# Altium project Project_BEESC.PrjPcb (part 1 of 4)
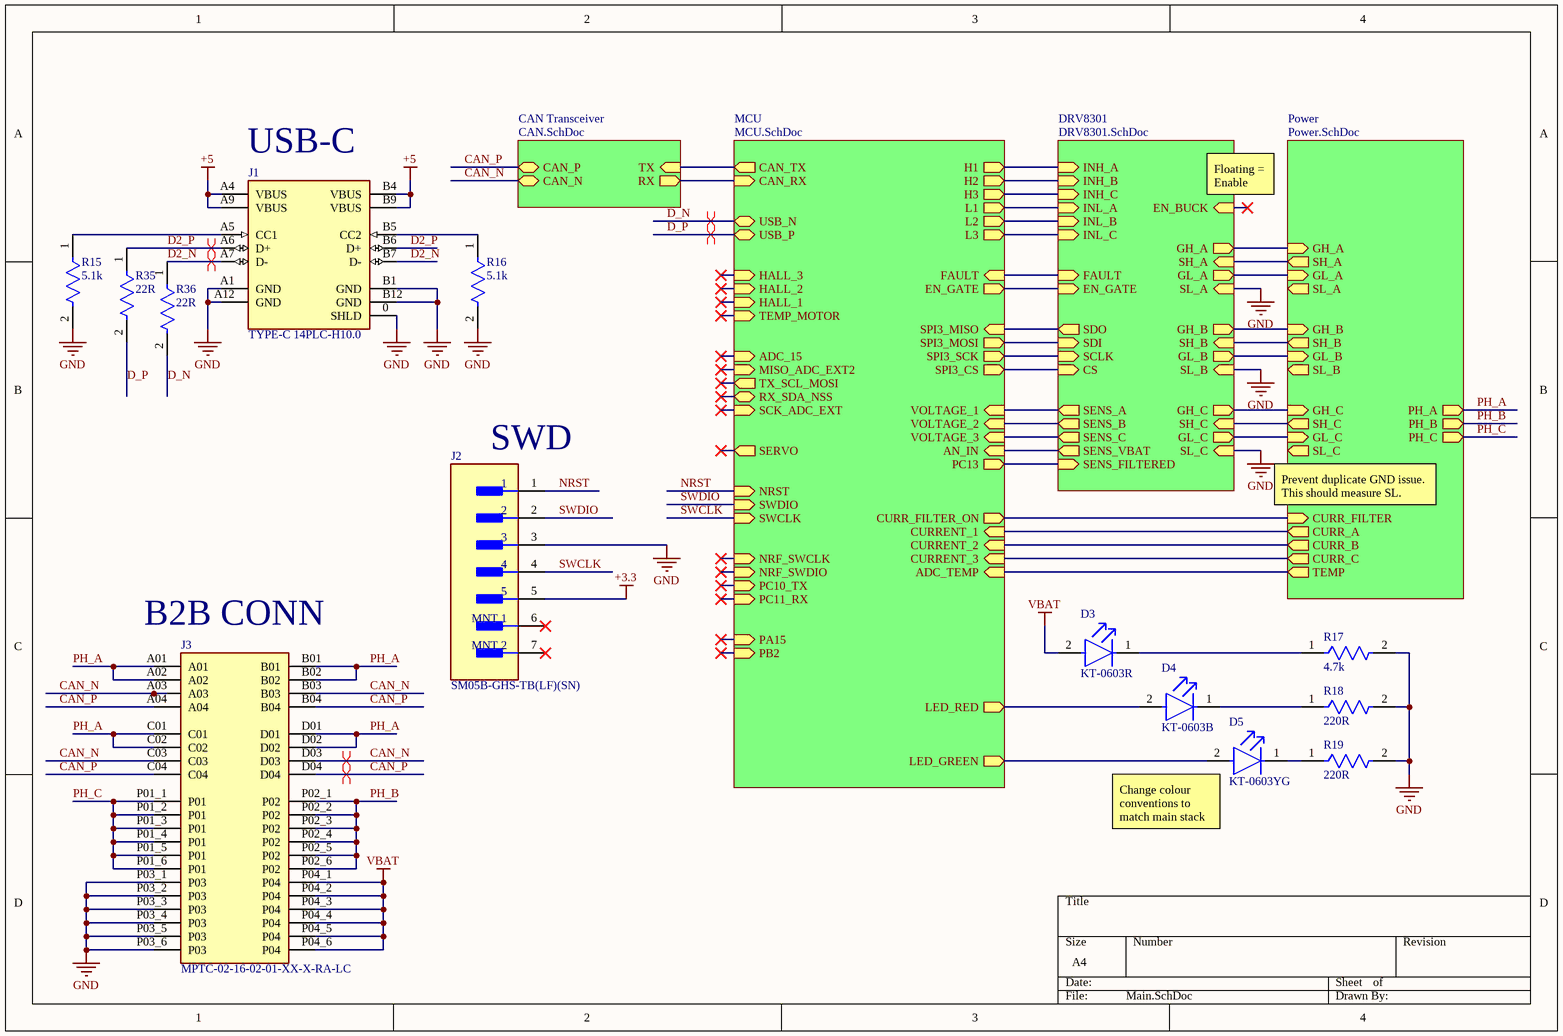
[diagram p0: Main.SchDoc]
5 sheets, 122 parts. Net scope: hierarchical (ports join the sheet entries above them; power ports are global).
Board files: BEESC_v1_L8.PcbDoc, BEESC_v1.PcbDoc
Sheets:
  Main.SchDoc
    MCU = MCU.SchDoc
    CAN Transceiver = CAN.SchDoc
    DRV8301 = DRV8301.SchDoc
    Power = Power.SchDoc

## Sheet Main.SchDoc
size A4; SheetNumber: 1; SheetTotal: 5

### Parts
D3  KT-0603R  [KT-0603R]
D4  KT-0603B  [KT-0603B]
D5  KT-0603YG  [KT-0603YG]
J1  TYPE-C 14PLC-H10.0  [TYPE-C 14PLC-H10.0]
J2  SM05B-GHS-TB(LF)(SN)  [SM05B-GHS-TB(LF)(SN)]
J3  MPTC-02-16-02-01-XX-X-RA-LC  [SAMTEC_MPTC-02-16-02-01-XX-X-RA-LC]
R15  5.1k  [FP-AC0402-MFG]
R16  5.1k  [FP-AC0402-MFG]
R17  4.7k  [FP-AC0402-MFG]
R18  220R  [FP-AC0402-MFG]
R19  220R  [FP-AC0402-MFG]
R35  22R  [FP-AC0402-MFG]
R36  22R  [FP-AC0402-MFG]

### Sub-sheets
CAN Transceiver = CAN.SchDoc: TX (in), RX (out), CAN_P (bidir), CAN_N (bidir)
DRV8301 = DRV8301.SchDoc: INH_A (in), INH_B (in), INH_C (in), INL_A (in), INL_B (in), INL_C (in), FAULT (in), EN_GATE (in), SDO (out), SDI (in), SCLK (in), CS (in), SENS_A (out), SENS_B (out), SENS_C (out), SENS_VBAT (out), SENS_FILTERED (in), GH_A (out), SH_A (in), GL_A (out), SL_A (in), EN_BUCK (in), GH_B (out), SH_B (in), GL_B (out), SL_B (in), GH_C (out), SH_C (in), GL_C (out), SL_C (in)
MCU = MCU.SchDoc: USB_N (bidir), USB_P (bidir), CAN_TX (out), CAN_RX (in), HALL_3 (in), HALL_2 (in), HALL_1 (in), TEMP_MOTOR (in), ADC_15 (in), MISO_ADC_EXT2 (in), TX_SCL_MOSI (out), RX_SDA_NSS (bidir), SCK_ADC_EXT (in), SERVO (out), SWCLK (in), SWDIO (in), NRST (in), NRF_SWCLK (in), NRF_SWDIO (in), PC10_TX (in), PC11_RX (in), PA15 (in), PB2 (in), LED_RED (out), LED_GREEN (out), H1 (out), H3 (out), H2 (out), L1 (out), L3 (out), L2 (out), FAULT (in), EN_GATE (out), SPI3_CS (out), SPI3_SCK (out), SPI3_MOSI (out), SPI3_MISO (in), VOLTAGE_1 (in), VOLTAGE_2 (in), VOLTAGE_3 (in), AN_IN (in), PC13 (out), CURR_FILTER_ON (out), CURRENT_1 (in), CURRENT_2 (in), CURRENT_3 (in), ADC_TEMP (in)
Power = Power.SchDoc: GH_A (in), SH_A (out), GL_A (in), SL_A (out), GH_B (in), SH_B (out), GL_B (in), SL_B (out), GH_C (in), SH_C (out), GL_C (in), SL_C (out), PH_A (out), PH_B (out), PH_C (out), CURR_FILTER (in), CURR_A (out), CURR_B (out), CURR_C (out), TEMP (out)

### Nets
+3.3: J2.5
+5: J1.A4(VBUS) J1.A9(VBUS) J1.B4(VBUS) J1.B9(VBUS)
GND: J1.0(SHLD) J1.A1(GND) J1.A12(GND) J1.B1(GND) J1.B12(GND) J2.3 J3.P03_1(P03) J3.P03_2(P03) J3.P03_3(P03) J3.P03_4(P03) J3.P03_5(P03) J3.P03_6(P03) R15.2 R16.2 R17.2 R18.2 R19.2 ; sheet DRV8301/SL_A, sheet DRV8301/SL_B, sheet DRV8301/SL_C
VBAT: D3.2(A) J3.P04_1(P04) J3.P04_2(P04) J3.P04_3(P04) J3.P04_4(P04) J3.P04_5(P04) J3.P04_6(P04)
ADC_TEMP: sheet MCU/ADC_TEMP, sheet Power/TEMP
AN_IN: sheet MCU/AN_IN, sheet DRV8301/SENS_VBAT
CAN_N: J3.A03 J3.B03 J3.C03 J3.D03 ; sheet CAN Transceiver/CAN_N
CAN_P: J3.A04 J3.B04 J3.C04 J3.D04 ; sheet CAN Transceiver/CAN_P
CAN_RX: sheet MCU/CAN_RX, sheet CAN Transceiver/RX
CAN_TX: sheet MCU/CAN_TX, sheet CAN Transceiver/TX
CS: sheet MCU/SPI3_CS, sheet DRV8301/CS
CURR_A: sheet MCU/CURRENT_1, sheet Power/CURR_A
CURR_B: sheet MCU/CURRENT_2, sheet Power/CURR_B
CURR_C: sheet MCU/CURRENT_3, sheet Power/CURR_C
CURR_FILTER: sheet MCU/CURR_FILTER_ON, sheet Power/CURR_FILTER
D2_N: J1.A7(D-) J1.B7(D-) R36.1
D2_P: J1.A6(D+) J1.B6(D+) R35.1
D_N: R36.2 ; sheet MCU/USB_N
D_P: R35.2 ; sheet MCU/USB_P
EN_GATE: sheet MCU/EN_GATE, sheet DRV8301/EN_GATE
FAULT: sheet MCU/FAULT, sheet DRV8301/FAULT
GH_A: sheet DRV8301/GH_A, sheet Power/GH_A
GH_B: sheet DRV8301/GH_B, sheet Power/GH_B
GH_C: sheet DRV8301/GH_C, sheet Power/GH_C
GL_A: sheet DRV8301/GL_A, sheet Power/GL_A
GL_B: sheet DRV8301/GL_B, sheet Power/GL_B
GL_C: sheet DRV8301/GL_C, sheet Power/GL_C
H1: sheet MCU/H1, sheet DRV8301/INH_A
H2: sheet MCU/H2, sheet DRV8301/INH_B
H3: sheet MCU/H3, sheet DRV8301/INH_C
INL_A: sheet MCU/L1, sheet DRV8301/INL_A
INL_B: sheet MCU/L2, sheet DRV8301/INL_B
INL_C: sheet MCU/L3, sheet DRV8301/INL_C
LED_GREEN: D5.2(A) ; sheet MCU/LED_GREEN
LED_RED: D4.2(A) ; sheet MCU/LED_RED
NRST: J2.1 ; sheet MCU/NRST
PC13: sheet MCU/PC13, sheet DRV8301/SENS_FILTERED
PH_A: J3.A01 J3.A02 J3.B01 J3.B02 J3.C01 J3.C02 J3.D01 J3.D02 ; sheet Power/PH_A
PH_B: J3.P02_1(P02) J3.P02_2(P02) J3.P02_3(P02) J3.P02_4(P02) J3.P02_5(P02) J3.P02_6(P02) ; sheet Power/PH_B
PH_C: J3.P01_1(P01) J3.P01_2(P01) J3.P01_3(P01) J3.P01_4(P01) J3.P01_5(P01) J3.P01_6(P01) ; sheet Power/PH_C
SCLK: sheet MCU/SPI3_SCK, sheet DRV8301/SCLK
SDI: sheet MCU/SPI3_MOSI, sheet DRV8301/SDI
SDO: sheet MCU/SPI3_MISO, sheet DRV8301/SDO
SENS_A: sheet MCU/VOLTAGE_1, sheet DRV8301/SENS_A
SENS_B: sheet MCU/VOLTAGE_2, sheet DRV8301/SENS_B
SENS_C: sheet MCU/VOLTAGE_3, sheet DRV8301/SENS_C
SH_A: sheet DRV8301/SH_A, sheet Power/SH_A
SH_B: sheet DRV8301/SH_B, sheet Power/SH_B
SH_C: sheet DRV8301/SH_C, sheet Power/SH_C
SWCLK: J2.4 ; sheet MCU/SWCLK
SWDIO: J2.2 ; sheet MCU/SWDIO
NetD3_1: D3.1(C) R17.1
NetD4_1: D4.1(C) R18.1
NetD5_1: D5.1(C) R19.1
NetJ1_A5: J1.A5(CC1) R15.1
NetJ1_B5: J1.B5(CC2) R16.1

Not connected (* = marked no-connect by the designer): J2 6(MNT_1)* 7(MNT_2)*

### Layout directives
differential pair: CAN_N, CAN_P, D2_N, D2_P, D_N, D_P

### Notes on the sheet
- (near J1) USB-C
- Floating = Enable
- (near J2) SWD
- Prevent duplicate GND issue.
  This should measure SL.
- (near J3) B2B CONN
- (near D5) Change colour conventions to match main stack

### Library data of the parts
D3 = KT-0603R: -40℃~+85℃ 120° 2.4V 20mA 300mcd 40mW 615nm~630nm 645nm Red Water Clear 0603 LED Indication - Discrete ROHS
D4 = KT-0603B: 100mW 120° 175mcd 3.1V 460nm~475nm 469nm 5mA Blue Water Clear 0603 LED Indication - Discrete ROHS
D5 = KT-0603YG: -40℃~+85℃ 120° 20mA 2V~2.2V 30mcd~42mcd 40mW 567nm~573nm Discrete Diode Top-mount Water Clear Yellow Green 0603 LED Indication - Discrete ROHS
J1 = TYPE-C 14PLC-H10.0: -40℃~+85℃ 1 10,000 Cycles 14P 20V 5A Black Female Through Hole Type-C USB 3.1 Plugin USB Connectors ROHS
J2 = SM05B-GHS-TB(LF)(SN): Connector Header, GH Series, 5 Position, 1.25mm, Surface Mount, Right Angle, Tin, Natural
J3 = CMP-414-000000-2: 5mm (.1969 Inch) / 2mm (.0787 Inch) Pitch Power / Signal, Board to Board / Wire to Board Shrouded Box Header Connectors, Vertical or Right Angle, Locking Clip Option, PowerStrip™/30 Amps; MF: Samtec; Price: None; Component Type: Standard; Pin Count: 40; MP: MPTC-02-16-02-01-XX-X-RA-LC; Design Item ID: MPTC-02-16-02-01-XX-X-RA-LC; Availability: Unavailable; Value: *; Package: None; Source: MPTC-02-16-02-01-XX-X-RA-LC.SchLib; System: Connector
R15 R16 = 0402WGF5101TCE: -55℃~+155℃ 5.1kΩ 50V 62.5mW Thick Film Resistor ±1% ±100ppm/℃ 0402 Chip Resistor - Surface Mount ROHS
R17 = 0402WGF4701TCE: -55℃~+155℃ 4.7kΩ 50V 62.5mW Thick Film Resistor ±1% ±100ppm/℃ 0402 Chip Resistor - Surface Mount ROHS
R18 R19 = 0402WGF2200TCE: -55℃~+155℃ 220Ω 50V 62.5mW Thick Film Resistor ±1% ±100ppm/℃ 0402 Chip Resistor - Surface Mount ROHS
R35 R36 = 0402WGF220JTCE: -55℃~+155℃ 22Ω 50V 62.5mW Thick Film Resistor ±1% ±100ppm/℃ 0402 Chip Resistor - Surface Mount ROHS

## Sheet MCU.SchDoc
size A4; SheetNumber: 3; SheetTotal: 5
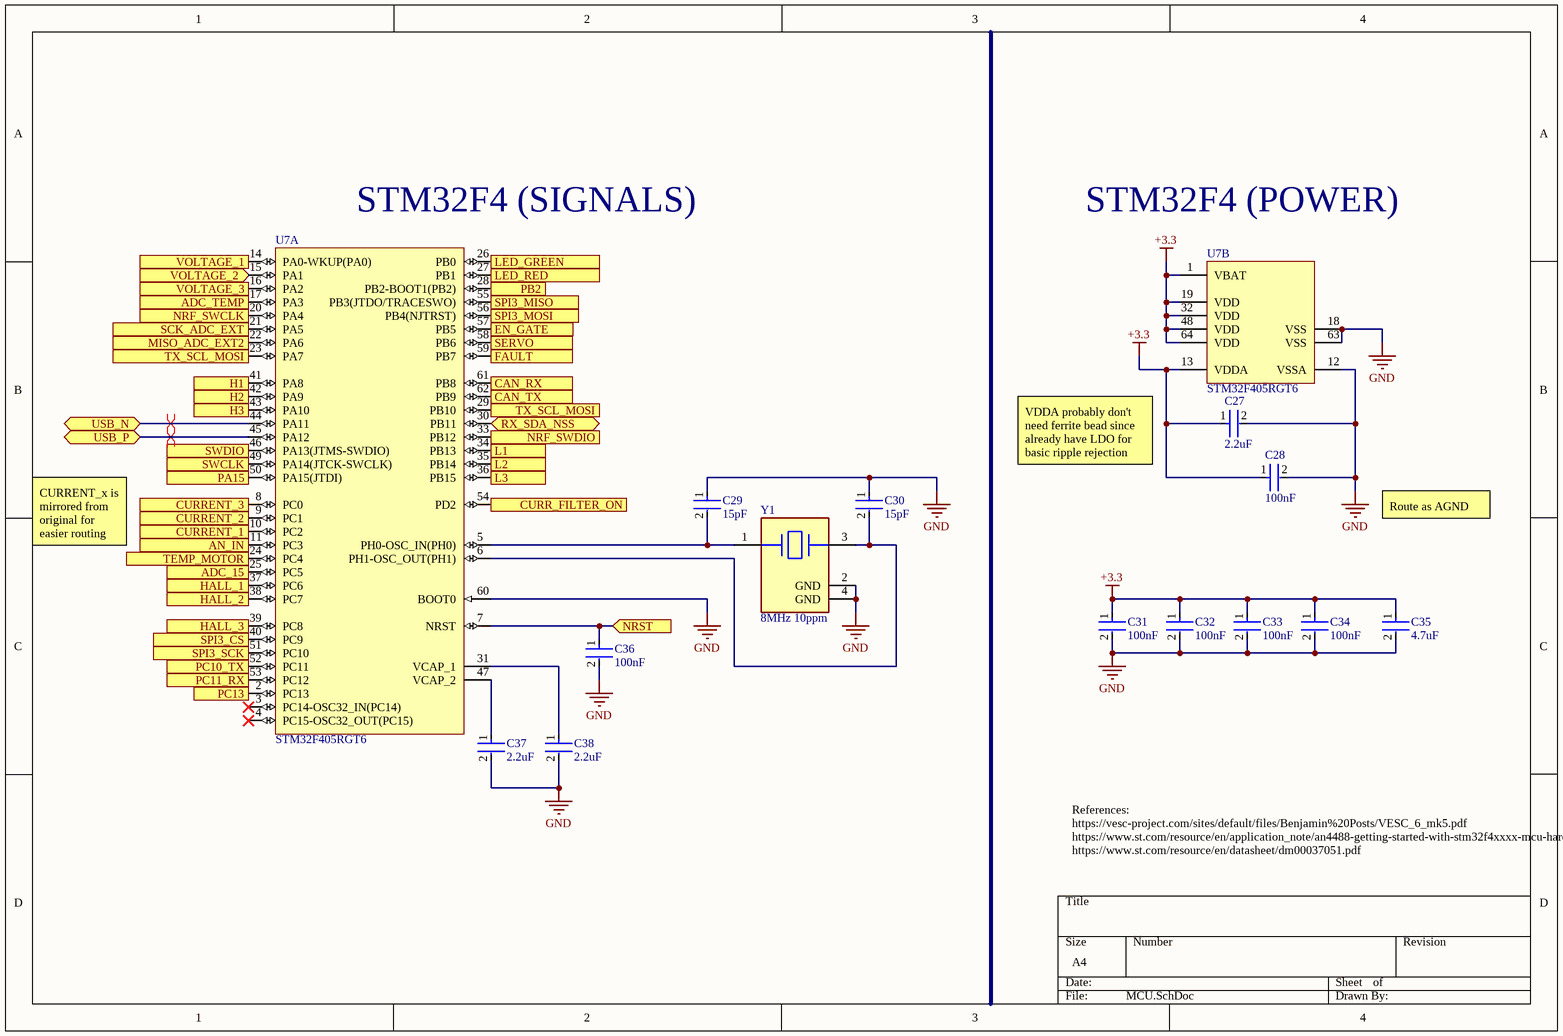
[diagram p1: MCU.SchDoc]

### Parts
C27  2.2uF  [FP-CC0805-0_85-MFG]
C28  100nF  [FP-CC0402-MFG]
C29  15pF  [FP-CC0402-MFG]
C30  15pF  [FP-CC0402-MFG]
C31  100nF  [FP-CC0402-MFG]
C32  100nF  [FP-CC0402-MFG]
C33  100nF  [FP-CC0402-MFG]
C34  100nF  [FP-CC0402-MFG]
C35  4.7uF  [FP-CC0805-0_85-MFG]
C36  100nF  [FP-CC0402-MFG]
C37  2.2uF  [FP-CC0805-0_85-MFG]
C38  2.2uF  [FP-CC0805-0_85-MFG]
U7  STM32F405RGT6  [FP-LQFP64-5W-MFG]  (parts A,B of 2)
Y1  8MHz 10ppm  [FP-ABM3B-MFG]

### Ports
ADC_15 (in, see Main[2B]), ADC_TEMP (in, see Main[3C]), AN_IN (in, see Main[3B]), CAN_RX (in, see Main[2A]), CAN_TX (out, see Main[2A]), CURR_FILTER_ON (out, see Main[3C]), CURRENT_1 (in, see Main[3C]), CURRENT_2 (in, see Main[3C]), CURRENT_3 (in, see Main[3C]), EN_GATE (out, see Main[3B], DRV8301[2B]), FAULT (in, see Main[3B], DRV8301[2A]), H1 (out, see Main[3A]), H2 (out, see Main[3A]), H3 (out, see Main[3A]), HALL_1 (in, see Main[2B]), HALL_2 (in, see Main[2B]), HALL_3 (in, see Main[2B]), L1 (out, see Main[3A]), L2 (out, see Main[3A]), L3 (out, see Main[3A]), LED_GREEN (out, see Main[3C]), LED_RED (out, see Main[3C]), MISO_ADC_EXT2 (in, see Main[2B]), NRF_SWCLK (in, see Main[2C]), NRF_SWDIO (in, see Main[2C]), NRST (in, see Main[2B]), PA15 (in, see Main[2C]), PB2 (in, see Main[2C]), PC10_TX (in, see Main[2C]), PC11_RX (in, see Main[2C]), PC13 (out, see Main[3B]), RX_SDA_NSS (bidir, see Main[2B]), SCK_ADC_EXT (in, see Main[2B]), SERVO (out, see Main[2B]), SPI3_CS (out, see Main[3B]), SPI3_MISO (in, see Main[3B]), SPI3_MOSI (out, see Main[3B]), SPI3_SCK (out, see Main[3B]), SWCLK (in, see Main[2C]), SWDIO (in, see Main[2B]), TEMP_MOTOR (in, see Main[2B]), TX_SCL_MOSI (out, see Main[2B]), USB_N (bidir, see Main[2A]), USB_P (bidir, see Main[2A]), VOLTAGE_1 (in, see Main[3B]), VOLTAGE_2 (in, see Main[3B]), VOLTAGE_3 (in, see Main[3B])

### Nets
+3.3: C27.1 C28.1 C31.1 C32.1 C33.1 C34.1 C35.1 U7.1(VBAT) U7.13(VDDA) U7.19(VDD) U7.32(VDD) U7.48(VDD) U7.64(VDD)
GND: C27.2 C28.2 C29.1 C30.1 C31.2 C32.2 C33.2 C34.2 C35.2 C36.2 C37.2 C38.2 U7.12(VSSA) U7.18(VSS) U7.60(BOOT0) U7.63(VSS) Y1.2(GND) Y1.4(GND)
ADC_15: U7.25(PC5) ; port ADC_15
ADC_TEMP: U7.17(PA3) ; port ADC_TEMP
AN_IN: U7.11(PC3) ; port AN_IN
CAN_RX: U7.61(PB8) ; port CAN_RX
CAN_TX: U7.62(PB9) ; port CAN_TX
CS: U7.40(PC9) ; port SPI3_CS
CURR_A: U7.10(PC2) ; port CURRENT_1
CURR_B: U7.9(PC1) ; port CURRENT_2
CURR_C: U7.8(PC0) ; port CURRENT_3
CURR_FILTER: U7.54(PD2) ; port CURR_FILTER_ON
D_N: U7.44(PA11) ; port USB_N
D_P: U7.45(PA12) ; port USB_P
EN_GATE: U7.57(PB5) ; port EN_GATE
FAULT: U7.59(PB7) ; port FAULT
H1: U7.41(PA8) ; port H1
H2: U7.42(PA9) ; port H2
H3: U7.43(PA10) ; port H3
HALL_1: U7.37(PC6) ; port HALL_1
HALL_2: U7.38(PC7) ; port HALL_2
HALL_3: U7.39(PC8) ; port HALL_3
INL_A: U7.34(PB13) ; port L1
INL_B: U7.35(PB14) ; port L2
INL_C: U7.36(PB15) ; port L3
LED_GREEN: U7.26(PB0) ; port LED_GREEN
LED_RED: U7.27(PB1) ; port LED_RED
MISO_ADC_EXT2: U7.22(PA6) ; port MISO_ADC_EXT2
NRF_SWCLK: U7.20(PA4) ; port NRF_SWCLK
NRF_SWDIO: U7.33(PB12) ; port NRF_SWDIO
NRST: C36.1 U7.7(NRST) ; port NRST
PA15: U7.50(PA15(JTDI)) ; port PA15
PB2: U7.28(PB2-BOOT1(PB2)) ; port PB2
PC10_TX: U7.52(PC11) ; port PC10_TX
PC11_RX: U7.53(PC12) ; port PC11_RX
PC13: U7.2(PC13) ; port PC13
RX_SDA_NSS: U7.30(PB11) ; port RX_SDA_NSS
SCK_ADC_EXT: U7.21(PA5) ; port SCK_ADC_EXT
SCLK: U7.51(PC10) ; port SPI3_SCK
SDI: U7.56(PB4(NJTRST)) ; port SPI3_MOSI
SDO: U7.55(PB3(JTDO/TRACESWO)) ; port SPI3_MISO
SENS_A: U7.14(PA0-WKUP(PA0)) ; port VOLTAGE_1
SENS_B: U7.15(PA1) ; port VOLTAGE_2
SENS_C: U7.16(PA2) ; port VOLTAGE_3
SERVO: U7.58(PB6) ; port SERVO
SWCLK: U7.49(PA14(JTCK-SWCLK)) ; port SWCLK
SWDIO: U7.46(PA13(JTMS-SWDIO)) ; port SWDIO
TEMP_MOTOR: U7.24(PC4) ; port TEMP_MOTOR
TX_SCL_MOSI: U7.23(PA7) U7.29(PB10) ; port TX_SCL_MOSI
NetC29_2: C29.2 U7.5(PH0-OSC_IN(PH0)) Y1.1
NetC30_2: C30.2 U7.6(PH1-OSC_OUT(PH1)) Y1.3
NetC37_1: C37.1 U7.47(VCAP_2)
NetC38_1: C38.1 U7.31(VCAP_1)

Not connected (* = marked no-connect by the designer): U7 3(PC14-OSC32_IN(PC14))* 4(PC15-OSC32_OUT(PC15))*

### Layout directives
differential pair: D_N, D_P

### Notes on the sheet
- (near U7) STM32F4 (SIGNALS)
- STM32F4 (POWER)
- VDDA probably don't need ferrite bead since already have LDO for basic ripple rejection
- Route as AGND
- CURRENT_x is mirrored from original for easier routing
- References:
  https://vesc-project.com/sites/default/files/Benjamin%20Posts/VESC_6_mk5.pdf
  https://www.st.com/resource/en/application_note/an4488-getting-started-with-stm32f4xxxx-mcu-hardware-development-stmicroelectronics.pdf
  https://www.st.com/resource/en/datasheet/dm00037051.pdf

### Library data of the parts
C27 C37 C38 = CC0805KKX7R9BB225: 2.2uF 50V X7R ±10% 0805 Multilayer Ceramic Capacitors MLCC - SMD/SMT ROHS; Manufacturer: Yageo Group; Manufacturer Part Number: CC0402KRX7R9BB682; Value: 6.8nF; Temperature Coefficient: 30ppm/°C; Supplier: DigiKey; Supplier Part Number: 311-1726-1-ND; RoHS: Compliant; Category: Ceramic Capacitors; Stock: 93415; Pricing: 1=0.1, 10=0.024, 50=0.0156, 100=0.0133, 500=0.00934, 1000=0.00812, 2500=0.00685, 5000=0.00609 (USD); Case/Package: 0402; Case Code (Imperial): 0402; Case Code (Metric): 1005; China RoHS: Compliant; Composition: Ceramic; Depth: 500µm; Dielectric: X7R; Dielectric Material: Ceramic; Halogen Free: Halogen Free; Height: 500µm; Lead Free: Lead Free; Length: 1mm; Lifecycle Status: Production; Material: Ceramic; Max Operating Temperature: 125°C; Min Operating Temperature: -55°C; Mounting Technology: Surface Mount; Pins: 2; Number of Terminals: 2; Packaging: Tape and Reel; Radiation Hardening: No; REACH SVHC: Yes; Schedule B: 8532240020, 8532240020|8532240020|8532240020|8532240020|8532240020|8532240020|8532240020|8532240020|8532240020|8532240020|8532240020|8532240020|8532240020|8532240020|8532240020|8532240020|8532240020|8532240020|8532240020|8532240020|8532240020|8532240020|8532240020|85; Termination: SMD/SMT; Thickness: 558.8µm; Tolerance: 10%; Voltage: 50V; Voltage Rating: 50V; Voltage Rating (DC): 50V; Weight: 652.039032µg; Width: 500µm; ComponentLink1URL: https://datasheet.octopart.com:443/CC0402KRX7R9BB682-Yageo-datasheet-177165144.pdf?src-supplier=IHS; ComponentLink1Description: https://datasheet.octopart.com:443/CC0402KRX7R9BB682-Yageo-datasheet-177165144.pdf?src-supplier=IHS; ComponentLink2URL: https://datasheet.octopart.com:443/CC0402KRX7R9BB682-Yageo-datasheet-78855684.pdf?src-supplier=Upverter; ComponentLink2Description: https://datasheet.octopart.com:443/CC0402KRX7R9BB682-Yageo-datasheet-78855684.pdf?src-supplier=Upverter; ComponentLink3URL: https://datasheet.octopart.com:443/CC0402KRX7R9BB682-Yageo-datasheet-147453679.pdf?src-supplier=Farnell; ComponentLink3Description: https://datasheet.octopart.com:443/CC0402KRX7R9BB682-Yageo-datasheet-147453679.pdf?src-supplier=Farnell; ComponentLink4URL: https://datasheet.octopart.com:443/CC0402KRX7R9BB682-Yageo-datasheet-182029474.pdf?src-supplier=Farnell; ComponentLink4Description: https://datasheet.octopart.com:443/CC0402KRX7R9BB682-Yageo-datasheet-182029474.pdf?src-supplier=Farnell; ComponentLink5URL: https://datasheet.octopart.com:443/CC0402KRX7R9BB682-Yageo-datasheet-140260305.pdf?src-supplier=element14+APAC; ComponentLink5Description: https://datasheet.octopart.com:443/CC0402KRX7R9BB682-Yageo-datasheet-140260305.pdf?src-supplier=element14+APAC; ComponentLink6URL: https://datasheet.octopart.com/CC0402KRX7R9BB682-Yageo-datasheet-10883670.pdf; ComponentLink6Description: https://datasheet.octopart.com/CC0402KRX7R9BB682-Yageo-datasheet-10883670.pdf; ComponentLink7URL: https://datasheet.octopart.com:443/CC0402KRX7R9BB682-Yageo-datasheet-166511530.pdf?src-supplier=Future+Electronics; ComponentLink7Description: https://datasheet.octopart.com:443/CC0402KRX7R9BB682-Yageo-datasheet-166511530.pdf?src-supplier=Future+Electronics; ComponentLink8URL: https://datasheet.octopart.com:443/CC0402KRX7R9BB682-Yageo-datasheet-137700082.pdf?src-supplier=Future+Electronics; ComponentLink8Description: https://datasheet.octopart.com:443/CC0402KRX7R9BB682-Yageo-datasheet-137700082.pdf?src-supplier=Future+Electronics; ComponentLink9URL: https://datasheet.octopart.com:443/CC0402KRX7R9BB682-Yageo-datasheet-137700084.pdf?src-supplier=Future+Electronics; ComponentLink9Description: https://datasheet.octopart.com:443/CC0402KRX7R9BB682-Yageo-datasheet-137700084.pdf?src-supplier=Future+Electronics; ComponentLink10URL: https://datasheet.octopart.com:443/CC0402KRX7R9BB682-Yageo-datasheet-27626582.pdf?src-supplier=Future+Electronics; ComponentLink10Description: https://datasheet.octopart.com:443/CC0402KRX7R9BB682-Yageo-datasheet-27626582.pdf?src-supplier=Future+Electronics; ComponentLink11URL: https://datasheet.octopart.com:443/CC0402KRX7R9BB682-Yageo-datasheet-24578986.pdf?src-supplier=Future+Electronics; ComponentLink11Description: https://datasheet.octopart.com:443/CC0402KRX7R9BB682-Yageo-datasheet-24578986.pdf?src-supplier=Future+Electronics; ComponentLink12URL: https://datasheet.octopart.com:443/CC0402KRX7R9BB682-Yageo-datasheet-15895757.pdf?src-supplier=Future+Electronics; ComponentLink12Description: https://datasheet.octopart.com:443/CC0402KRX7R9BB682-Yageo-datasheet-15895757.pdf?src-supplier=Future+Electronics; ComponentLink13URL: https://datasheet.octopart.com:443/CC0402KRX7R9BB682-Yageo-datasheet-12526321.pdf?src-supplier=Future+Electronics; ComponentLink13Description: https://datasheet.octopart.com:443/CC0402KRX7R9BB682-Yageo-datasheet-12526321.pdf?src-supplier=Future+Electronics; ComponentLink14URL: https://datasheet.octopart.com:443/CC0402KRX7R9BB682-Yageo-datasheet-178018872.pdf?src-supplier=Burklin+Elektronik; ComponentLink14Description: https://datasheet.octopart.com:443/CC0402KRX7R9BB682-Yageo-datasheet-178018872.pdf?src-supplier=Burklin+Elektronik; ComponentLink15URL: https://datasheet.octopart.com:443/CC0402KRX7R9BB682-Yageo-Group-datasheet-165992755.pdf?src-supplier=ODG+(Origin+Data+Global); ComponentLink15Description: https://datasheet.octopart.com:443/CC0402KRX7R9BB682-Yageo-Group-datasheet-165992755.pdf?src-supplier=ODG+(Origin+Data+Global); ComponentLink16URL: https://datasheet.octopart.com:443/CC0402KRX7R9BB682-Yageo-datasheet-120101875.pdf?src-supplier=Megastar; ComponentLink16Description: https://datasheet.octopart.com:443/CC0402KRX7R9BB682-Yageo-datasheet-120101875.pdf?src-supplier=Megastar; ComponentLink17URL: https://datasheet.octopart.com:443/CC0402KRX7R9BB682-Yageo-datasheet-62336348.pdf?src-supplier=Newark; ComponentLink17Description: https://datasheet.octopart.com:443/CC0402KRX7R9BB682-Yageo-datasheet-62336348.pdf?src-supplier=Newark; ComponentLink18URL: http://sigma.octopart.com:80/conflict_mineral_statement/Yageo-company-3.pdf?src-supplier=Compliance+Statements; ComponentLink18Description: http://sigma.octopart.com:80/conflict_mineral_statement/Yageo-company-3.pdf?src-supplier=Compliance+Statements; ComponentLink19URL: http://sigma.octopart.com:80/rohs_statement/Yageo-company-2.pdf?src-supplier=Compliance+Statements; ComponentLink19Description: http://sigma.octopart.com:80/rohs_statement/Yageo-company-2.pdf?src-supplier=Compliance+Statements
C28 C31-C34 C36 = CL05B104KB54PNC: 100nF 50V X7R ±10% 0402 Multilayer Ceramic Capacitors MLCC - SMD/SMT ROHS; Manufacturer: Yageo Group; Manufacturer Part Number: CC0402KRX7R9BB682; Value: 6.8nF; Temperature Coefficient: 30ppm/°C; Supplier: DigiKey; Supplier Part Number: 311-1726-1-ND; RoHS: Compliant; Category: Ceramic Capacitors; Stock: 93415; Pricing: 1=0.1, 10=0.024, 50=0.0156, 100=0.0133, 500=0.00934, 1000=0.00812, 2500=0.00685, 5000=0.00609 (USD); Case/Package: 0402; Case Code (Imperial): 0402; Case Code (Metric): 1005; China RoHS: Compliant; Composition: Ceramic; Depth: 500µm; Dielectric: X7R; Dielectric Material: Ceramic; Halogen Free: Halogen Free; Height: 500µm; Lead Free: Lead Free; Length: 1mm; Lifecycle Status: Production; Material: Ceramic; Max Operating Temperature: 125°C; Min Operating Temperature: -55°C; Mounting Technology: Surface Mount; Pins: 2; Number of Terminals: 2; Packaging: Tape and Reel; Radiation Hardening: No; REACH SVHC: Yes; Schedule B: 8532240020, 8532240020|8532240020|8532240020|8532240020|8532240020|8532240020|8532240020|8532240020|8532240020|8532240020|8532240020|8532240020|8532240020|8532240020|8532240020|8532240020|8532240020|8532240020|8532240020|8532240020|8532240020|8532240020|8532240020|85; Termination: SMD/SMT; Thickness: 558.8µm; Tolerance: 10%; Voltage: 50V; Voltage Rating: 50V; Voltage Rating (DC): 50V; Weight: 652.039032µg; Width: 500µm; ComponentLink1URL: https://datasheet.octopart.com:443/CC0402KRX7R9BB682-Yageo-datasheet-177165144.pdf?src-supplier=IHS; ComponentLink1Description: https://datasheet.octopart.com:443/CC0402KRX7R9BB682-Yageo-datasheet-177165144.pdf?src-supplier=IHS; ComponentLink2URL: https://datasheet.octopart.com:443/CC0402KRX7R9BB682-Yageo-datasheet-78855684.pdf?src-supplier=Upverter; ComponentLink2Description: https://datasheet.octopart.com:443/CC0402KRX7R9BB682-Yageo-datasheet-78855684.pdf?src-supplier=Upverter; ComponentLink3URL: https://datasheet.octopart.com:443/CC0402KRX7R9BB682-Yageo-datasheet-147453679.pdf?src-supplier=Farnell; ComponentLink3Description: https://datasheet.octopart.com:443/CC0402KRX7R9BB682-Yageo-datasheet-147453679.pdf?src-supplier=Farnell; ComponentLink4URL: https://datasheet.octopart.com:443/CC0402KRX7R9BB682-Yageo-datasheet-182029474.pdf?src-supplier=Farnell; ComponentLink4Description: https://datasheet.octopart.com:443/CC0402KRX7R9BB682-Yageo-datasheet-182029474.pdf?src-supplier=Farnell; ComponentLink5URL: https://datasheet.octopart.com:443/CC0402KRX7R9BB682-Yageo-datasheet-140260305.pdf?src-supplier=element14+APAC; ComponentLink5Description: https://datasheet.octopart.com:443/CC0402KRX7R9BB682-Yageo-datasheet-140260305.pdf?src-supplier=element14+APAC; ComponentLink6URL: https://datasheet.octopart.com/CC0402KRX7R9BB682-Yageo-datasheet-10883670.pdf; ComponentLink6Description: https://datasheet.octopart.com/CC0402KRX7R9BB682-Yageo-datasheet-10883670.pdf; ComponentLink7URL: https://datasheet.octopart.com:443/CC0402KRX7R9BB682-Yageo-datasheet-166511530.pdf?src-supplier=Future+Electronics; ComponentLink7Description: https://datasheet.octopart.com:443/CC0402KRX7R9BB682-Yageo-datasheet-166511530.pdf?src-supplier=Future+Electronics; ComponentLink8URL: https://datasheet.octopart.com:443/CC0402KRX7R9BB682-Yageo-datasheet-137700082.pdf?src-supplier=Future+Electronics; ComponentLink8Description: https://datasheet.octopart.com:443/CC0402KRX7R9BB682-Yageo-datasheet-137700082.pdf?src-supplier=Future+Electronics; ComponentLink9URL: https://datasheet.octopart.com:443/CC0402KRX7R9BB682-Yageo-datasheet-137700084.pdf?src-supplier=Future+Electronics; ComponentLink9Description: https://datasheet.octopart.com:443/CC0402KRX7R9BB682-Yageo-datasheet-137700084.pdf?src-supplier=Future+Electronics; ComponentLink10URL: https://datasheet.octopart.com:443/CC0402KRX7R9BB682-Yageo-datasheet-27626582.pdf?src-supplier=Future+Electronics; ComponentLink10Description: https://datasheet.octopart.com:443/CC0402KRX7R9BB682-Yageo-datasheet-27626582.pdf?src-supplier=Future+Electronics; ComponentLink11URL: https://datasheet.octopart.com:443/CC0402KRX7R9BB682-Yageo-datasheet-24578986.pdf?src-supplier=Future+Electronics; ComponentLink11Description: https://datasheet.octopart.com:443/CC0402KRX7R9BB682-Yageo-datasheet-24578986.pdf?src-supplier=Future+Electronics; ComponentLink12URL: https://datasheet.octopart.com:443/CC0402KRX7R9BB682-Yageo-datasheet-15895757.pdf?src-supplier=Future+Electronics; ComponentLink12Description: https://datasheet.octopart.com:443/CC0402KRX7R9BB682-Yageo-datasheet-15895757.pdf?src-supplier=Future+Electronics; ComponentLink13URL: https://datasheet.octopart.com:443/CC0402KRX7R9BB682-Yageo-datasheet-12526321.pdf?src-supplier=Future+Electronics; ComponentLink13Description: https://datasheet.octopart.com:443/CC0402KRX7R9BB682-Yageo-datasheet-12526321.pdf?src-supplier=Future+Electronics; ComponentLink14URL: https://datasheet.octopart.com:443/CC0402KRX7R9BB682-Yageo-datasheet-178018872.pdf?src-supplier=Burklin+Elektronik; ComponentLink14Description: https://datasheet.octopart.com:443/CC0402KRX7R9BB682-Yageo-datasheet-178018872.pdf?src-supplier=Burklin+Elektronik; ComponentLink15URL: https://datasheet.octopart.com:443/CC0402KRX7R9BB682-Yageo-Group-datasheet-165992755.pdf?src-supplier=ODG+(Origin+Data+Global); ComponentLink15Description: https://datasheet.octopart.com:443/CC0402KRX7R9BB682-Yageo-Group-datasheet-165992755.pdf?src-supplier=ODG+(Origin+Data+Global); ComponentLink16URL: https://datasheet.octopart.com:443/CC0402KRX7R9BB682-Yageo-datasheet-120101875.pdf?src-supplier=Megastar; ComponentLink16Description: https://datasheet.octopart.com:443/CC0402KRX7R9BB682-Yageo-datasheet-120101875.pdf?src-supplier=Megastar; ComponentLink17URL: https://datasheet.octopart.com:443/CC0402KRX7R9BB682-Yageo-datasheet-62336348.pdf?src-supplier=Newark; ComponentLink17Description: https://datasheet.octopart.com:443/CC0402KRX7R9BB682-Yageo-datasheet-62336348.pdf?src-supplier=Newark; ComponentLink18URL: http://sigma.octopart.com:80/conflict_mineral_statement/Yageo-company-3.pdf?src-supplier=Compliance+Statements; ComponentLink18Description: http://sigma.octopart.com:80/conflict_mineral_statement/Yageo-company-3.pdf?src-supplier=Compliance+Statements; ComponentLink19URL: http://sigma.octopart.com:80/rohs_statement/Yageo-company-2.pdf?src-supplier=Compliance+Statements; ComponentLink19Description: http://sigma.octopart.com:80/rohs_statement/Yageo-company-2.pdf?src-supplier=Compliance+Statements
C29 C30 = 0402CG150J500NT: 15pF 50V C0G ±5% 0402 Multilayer Ceramic Capacitors MLCC - SMD/SMT ROHS; Manufacturer: Yageo Group; Manufacturer Part Number: CC0402KRX7R9BB682; Value: 6.8nF; Dielectric: X7R; Temperature Coefficient: 30ppm/°C; Tolerance: 10%; Supplier: DigiKey; Supplier Part Number: 311-1726-1-ND; RoHS: Compliant; Category: Ceramic Capacitors; Stock: 93415; Pricing: 1=0.1, 10=0.024, 50=0.0156, 100=0.0133, 500=0.00934, 1000=0.00812, 2500=0.00685, 5000=0.00609 (USD); Case/Package: 0402; Case Code (Imperial): 0402; Case Code (Metric): 1005; China RoHS: Compliant; Composition: Ceramic; Depth: 500µm; Dielectric Material: Ceramic; Halogen Free: Halogen Free; Height: 500µm; Lead Free: Lead Free; Length: 1mm; Lifecycle Status: Production; Material: Ceramic; Max Operating Temperature: 125°C; Min Operating Temperature: -55°C; Mounting Technology: Surface Mount; Pins: 2; Number of Terminals: 2; Packaging: Tape and Reel; Radiation Hardening: No; REACH SVHC: Yes; Schedule B: 8532240020, 8532240020|8532240020|8532240020|8532240020|8532240020|8532240020|8532240020|8532240020|8532240020|8532240020|8532240020|8532240020|8532240020|8532240020|8532240020|8532240020|8532240020|8532240020|8532240020|8532240020|8532240020|8532240020|8532240020|85; Termination: SMD/SMT; Thickness: 558.8µm; Voltage: 50V; Voltage Rating: 50V; Voltage Rating (DC): 50V; Weight: 652.039032µg; Width: 500µm; ComponentLink1URL: https://datasheet.octopart.com:443/CC0402KRX7R9BB682-Yageo-datasheet-177165144.pdf?src-supplier=IHS; ComponentLink1Description: https://datasheet.octopart.com:443/CC0402KRX7R9BB682-Yageo-datasheet-177165144.pdf?src-supplier=IHS; ComponentLink2URL: https://datasheet.octopart.com:443/CC0402KRX7R9BB682-Yageo-datasheet-78855684.pdf?src-supplier=Upverter; ComponentLink2Description: https://datasheet.octopart.com:443/CC0402KRX7R9BB682-Yageo-datasheet-78855684.pdf?src-supplier=Upverter; ComponentLink3URL: https://datasheet.octopart.com:443/CC0402KRX7R9BB682-Yageo-datasheet-147453679.pdf?src-supplier=Farnell; ComponentLink3Description: https://datasheet.octopart.com:443/CC0402KRX7R9BB682-Yageo-datasheet-147453679.pdf?src-supplier=Farnell; ComponentLink4URL: https://datasheet.octopart.com:443/CC0402KRX7R9BB682-Yageo-datasheet-182029474.pdf?src-supplier=Farnell; ComponentLink4Description: https://datasheet.octopart.com:443/CC0402KRX7R9BB682-Yageo-datasheet-182029474.pdf?src-supplier=Farnell; ComponentLink5URL: https://datasheet.octopart.com:443/CC0402KRX7R9BB682-Yageo-datasheet-140260305.pdf?src-supplier=element14+APAC; ComponentLink5Description: https://datasheet.octopart.com:443/CC0402KRX7R9BB682-Yageo-datasheet-140260305.pdf?src-supplier=element14+APAC; ComponentLink6URL: https://datasheet.octopart.com/CC0402KRX7R9BB682-Yageo-datasheet-10883670.pdf; ComponentLink6Description: https://datasheet.octopart.com/CC0402KRX7R9BB682-Yageo-datasheet-10883670.pdf; ComponentLink7URL: https://datasheet.octopart.com:443/CC0402KRX7R9BB682-Yageo-datasheet-166511530.pdf?src-supplier=Future+Electronics; ComponentLink7Description: https://datasheet.octopart.com:443/CC0402KRX7R9BB682-Yageo-datasheet-166511530.pdf?src-supplier=Future+Electronics; ComponentLink8URL: https://datasheet.octopart.com:443/CC0402KRX7R9BB682-Yageo-datasheet-137700082.pdf?src-supplier=Future+Electronics; ComponentLink8Description: https://datasheet.octopart.com:443/CC0402KRX7R9BB682-Yageo-datasheet-137700082.pdf?src-supplier=Future+Electronics; ComponentLink9URL: https://datasheet.octopart.com:443/CC0402KRX7R9BB682-Yageo-datasheet-137700084.pdf?src-supplier=Future+Electronics; ComponentLink9Description: https://datasheet.octopart.com:443/CC0402KRX7R9BB682-Yageo-datasheet-137700084.pdf?src-supplier=Future+Electronics; ComponentLink10URL: https://datasheet.octopart.com:443/CC0402KRX7R9BB682-Yageo-datasheet-27626582.pdf?src-supplier=Future+Electronics; ComponentLink10Description: https://datasheet.octopart.com:443/CC0402KRX7R9BB682-Yageo-datasheet-27626582.pdf?src-supplier=Future+Electronics; ComponentLink11URL: https://datasheet.octopart.com:443/CC0402KRX7R9BB682-Yageo-datasheet-24578986.pdf?src-supplier=Future+Electronics; ComponentLink11Description: https://datasheet.octopart.com:443/CC0402KRX7R9BB682-Yageo-datasheet-24578986.pdf?src-supplier=Future+Electronics; ComponentLink12URL: https://datasheet.octopart.com:443/CC0402KRX7R9BB682-Yageo-datasheet-15895757.pdf?src-supplier=Future+Electronics; ComponentLink12Description: https://datasheet.octopart.com:443/CC0402KRX7R9BB682-Yageo-datasheet-15895757.pdf?src-supplier=Future+Electronics; ComponentLink13URL: https://datasheet.octopart.com:443/CC0402KRX7R9BB682-Yageo-datasheet-12526321.pdf?src-supplier=Future+Electronics; ComponentLink13Description: https://datasheet.octopart.com:443/CC0402KRX7R9BB682-Yageo-datasheet-12526321.pdf?src-supplier=Future+Electronics; ComponentLink14URL: https://datasheet.octopart.com:443/CC0402KRX7R9BB682-Yageo-datasheet-178018872.pdf?src-supplier=Burklin+Elektronik; ComponentLink14Description: https://datasheet.octopart.com:443/CC0402KRX7R9BB682-Yageo-datasheet-178018872.pdf?src-supplier=Burklin+Elektronik; ComponentLink15URL: https://datasheet.octopart.com:443/CC0402KRX7R9BB682-Yageo-Group-datasheet-165992755.pdf?src-supplier=ODG+(Origin+Data+Global); ComponentLink15Description: https://datasheet.octopart.com:443/CC0402KRX7R9BB682-Yageo-Group-datasheet-165992755.pdf?src-supplier=ODG+(Origin+Data+Global); ComponentLink16URL: https://datasheet.octopart.com:443/CC0402KRX7R9BB682-Yageo-datasheet-120101875.pdf?src-supplier=Megastar; ComponentLink16Description: https://datasheet.octopart.com:443/CC0402KRX7R9BB682-Yageo-datasheet-120101875.pdf?src-supplier=Megastar; ComponentLink17URL: https://datasheet.octopart.com:443/CC0402KRX7R9BB682-Yageo-datasheet-62336348.pdf?src-supplier=Newark; ComponentLink17Description: https://datasheet.octopart.com:443/CC0402KRX7R9BB682-Yageo-datasheet-62336348.pdf?src-supplier=Newark; ComponentLink18URL: http://sigma.octopart.com:80/conflict_mineral_statement/Yageo-company-3.pdf?src-supplier=Compliance+Statements; ComponentLink18Description: http://sigma.octopart.com:80/conflict_mineral_statement/Yageo-company-3.pdf?src-supplier=Compliance+Statements; ComponentLink19URL: http://sigma.octopart.com:80/rohs_statement/Yageo-company-2.pdf?src-supplier=Compliance+Statements; ComponentLink19Description: http://sigma.octopart.com:80/rohs_statement/Yageo-company-2.pdf?src-supplier=Compliance+Statements
C35 = 0805B475K500NT: 4.7uF 50V X7R ±10% 0805 Multilayer Ceramic Capacitors MLCC - SMD/SMT ROHS; Manufacturer: Yageo Group; Manufacturer Part Number: CC0402KRX7R9BB682; Value: 6.8nF; Temperature Coefficient: 30ppm/°C; Supplier: DigiKey; Supplier Part Number: 311-1726-1-ND; RoHS: Compliant; Category: Ceramic Capacitors; Stock: 93415; Pricing: 1=0.1, 10=0.024, 50=0.0156, 100=0.0133, 500=0.00934, 1000=0.00812, 2500=0.00685, 5000=0.00609 (USD); Case/Package: 0402; Case Code (Imperial): 0402; Case Code (Metric): 1005; China RoHS: Compliant; Composition: Ceramic; Depth: 500µm; Dielectric: X7R; Dielectric Material: Ceramic; Halogen Free: Halogen Free; Height: 500µm; Lead Free: Lead Free; Length: 1mm; Lifecycle Status: Production; Material: Ceramic; Max Operating Temperature: 125°C; Min Operating Temperature: -55°C; Mounting Technology: Surface Mount; Pins: 2; Number of Terminals: 2; Packaging: Tape and Reel; Radiation Hardening: No; REACH SVHC: Yes; Schedule B: 8532240020, 8532240020|8532240020|8532240020|8532240020|8532240020|8532240020|8532240020|8532240020|8532240020|8532240020|8532240020|8532240020|8532240020|8532240020|8532240020|8532240020|8532240020|8532240020|8532240020|8532240020|8532240020|8532240020|8532240020|85; Termination: SMD/SMT; Thickness: 558.8µm; Tolerance: 10%; Voltage: 50V; Voltage Rating: 50V; Voltage Rating (DC): 50V; Weight: 652.039032µg; Width: 500µm; ComponentLink1URL: https://datasheet.octopart.com:443/CC0402KRX7R9BB682-Yageo-datasheet-177165144.pdf?src-supplier=IHS; ComponentLink1Description: https://datasheet.octopart.com:443/CC0402KRX7R9BB682-Yageo-datasheet-177165144.pdf?src-supplier=IHS; ComponentLink2URL: https://datasheet.octopart.com:443/CC0402KRX7R9BB682-Yageo-datasheet-78855684.pdf?src-supplier=Upverter; ComponentLink2Description: https://datasheet.octopart.com:443/CC0402KRX7R9BB682-Yageo-datasheet-78855684.pdf?src-supplier=Upverter; ComponentLink3URL: https://datasheet.octopart.com:443/CC0402KRX7R9BB682-Yageo-datasheet-147453679.pdf?src-supplier=Farnell; ComponentLink3Description: https://datasheet.octopart.com:443/CC0402KRX7R9BB682-Yageo-datasheet-147453679.pdf?src-supplier=Farnell; ComponentLink4URL: https://datasheet.octopart.com:443/CC0402KRX7R9BB682-Yageo-datasheet-182029474.pdf?src-supplier=Farnell; ComponentLink4Description: https://datasheet.octopart.com:443/CC0402KRX7R9BB682-Yageo-datasheet-182029474.pdf?src-supplier=Farnell; ComponentLink5URL: https://datasheet.octopart.com:443/CC0402KRX7R9BB682-Yageo-datasheet-140260305.pdf?src-supplier=element14+APAC; ComponentLink5Description: https://datasheet.octopart.com:443/CC0402KRX7R9BB682-Yageo-datasheet-140260305.pdf?src-supplier=element14+APAC; ComponentLink6URL: https://datasheet.octopart.com/CC0402KRX7R9BB682-Yageo-datasheet-10883670.pdf; ComponentLink6Description: https://datasheet.octopart.com/CC0402KRX7R9BB682-Yageo-datasheet-10883670.pdf; ComponentLink7URL: https://datasheet.octopart.com:443/CC0402KRX7R9BB682-Yageo-datasheet-166511530.pdf?src-supplier=Future+Electronics; ComponentLink7Description: https://datasheet.octopart.com:443/CC0402KRX7R9BB682-Yageo-datasheet-166511530.pdf?src-supplier=Future+Electronics; ComponentLink8URL: https://datasheet.octopart.com:443/CC0402KRX7R9BB682-Yageo-datasheet-137700082.pdf?src-supplier=Future+Electronics; ComponentLink8Description: https://datasheet.octopart.com:443/CC0402KRX7R9BB682-Yageo-datasheet-137700082.pdf?src-supplier=Future+Electronics; ComponentLink9URL: https://datasheet.octopart.com:443/CC0402KRX7R9BB682-Yageo-datasheet-137700084.pdf?src-supplier=Future+Electronics; ComponentLink9Description: https://datasheet.octopart.com:443/CC0402KRX7R9BB682-Yageo-datasheet-137700084.pdf?src-supplier=Future+Electronics; ComponentLink10URL: https://datasheet.octopart.com:443/CC0402KRX7R9BB682-Yageo-datasheet-27626582.pdf?src-supplier=Future+Electronics; ComponentLink10Description: https://datasheet.octopart.com:443/CC0402KRX7R9BB682-Yageo-datasheet-27626582.pdf?src-supplier=Future+Electronics; ComponentLink11URL: https://datasheet.octopart.com:443/CC0402KRX7R9BB682-Yageo-datasheet-24578986.pdf?src-supplier=Future+Electronics; ComponentLink11Description: https://datasheet.octopart.com:443/CC0402KRX7R9BB682-Yageo-datasheet-24578986.pdf?src-supplier=Future+Electronics; ComponentLink12URL: https://datasheet.octopart.com:443/CC0402KRX7R9BB682-Yageo-datasheet-15895757.pdf?src-supplier=Future+Electronics; ComponentLink12Description: https://datasheet.octopart.com:443/CC0402KRX7R9BB682-Yageo-datasheet-15895757.pdf?src-supplier=Future+Electronics; ComponentLink13URL: https://datasheet.octopart.com:443/CC0402KRX7R9BB682-Yageo-datasheet-12526321.pdf?src-supplier=Future+Electronics; ComponentLink13Description: https://datasheet.octopart.com:443/CC0402KRX7R9BB682-Yageo-datasheet-12526321.pdf?src-supplier=Future+Electronics; ComponentLink14URL: https://datasheet.octopart.com:443/CC0402KRX7R9BB682-Yageo-datasheet-178018872.pdf?src-supplier=Burklin+Elektronik; ComponentLink14Description: https://datasheet.octopart.com:443/CC0402KRX7R9BB682-Yageo-datasheet-178018872.pdf?src-supplier=Burklin+Elektronik; ComponentLink15URL: https://datasheet.octopart.com:443/CC0402KRX7R9BB682-Yageo-Group-datasheet-165992755.pdf?src-supplier=ODG+(Origin+Data+Global); ComponentLink15Description: https://datasheet.octopart.com:443/CC0402KRX7R9BB682-Yageo-Group-datasheet-165992755.pdf?src-supplier=ODG+(Origin+Data+Global); ComponentLink16URL: https://datasheet.octopart.com:443/CC0402KRX7R9BB682-Yageo-datasheet-120101875.pdf?src-supplier=Megastar; ComponentLink16Description: https://datasheet.octopart.com:443/CC0402KRX7R9BB682-Yageo-datasheet-120101875.pdf?src-supplier=Megastar; ComponentLink17URL: https://datasheet.octopart.com:443/CC0402KRX7R9BB682-Yageo-datasheet-62336348.pdf?src-supplier=Newark; ComponentLink17Description: https://datasheet.octopart.com:443/CC0402KRX7R9BB682-Yageo-datasheet-62336348.pdf?src-supplier=Newark; ComponentLink18URL: http://sigma.octopart.com:80/conflict_mineral_statement/Yageo-company-3.pdf?src-supplier=Compliance+Statements; ComponentLink18Description: http://sigma.octopart.com:80/conflict_mineral_statement/Yageo-company-3.pdf?src-supplier=Compliance+Statements; ComponentLink19URL: http://sigma.octopart.com:80/rohs_statement/Yageo-company-2.pdf?src-supplier=Compliance+Statements; ComponentLink19Description: http://sigma.octopart.com:80/rohs_statement/Yageo-company-2.pdf?src-supplier=Compliance+Statements
U7 = STM32F405RGT6: -40℃~+85℃ 1.8V~3.6V 12bit 12bit 168MHz 192KB 1MB 32 Bit 51 ARM Cortex-M4 Built-in FLASH LQFP-64(10x10) Microcontrollers (MCU/MPU/SOC) ROHS
Y1 = ABM3B-8.000MHZ-10-1-U-T: -10℃~+60℃ 10pF 200Ω 8MHz ±10ppm ±10ppm SMD5032-4P Crystals ROHS